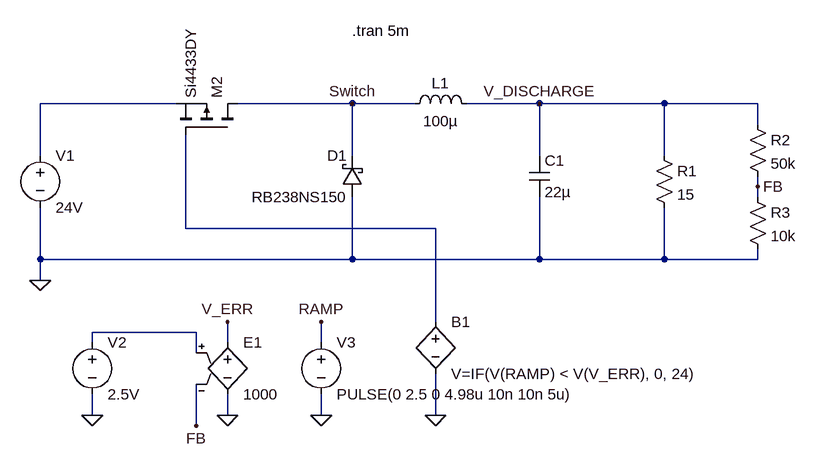
[diagram p0: schematic low_voltage_bucks.asc]
low_voltage_bucks.asc, the LTspice schematic file:
Version 4
SHEET 1 1580 680
WIRE 400 96 192 96
WIRE 672 96 496 96
WIRE 768 96 672 96
WIRE 960 96 848 96
WIRE 1152 96 960 96
WIRE 1296 96 1152 96
WIRE 1296 128 1296 96
WIRE 192 176 192 96
WIRE 672 176 672 96
WIRE 960 176 960 96
WIRE 1152 176 1152 96
WIRE 1296 224 1296 208
WIRE 1296 240 1296 224
WIRE 416 288 416 144
WIRE 800 288 416 288
WIRE 192 336 192 256
WIRE 672 336 672 240
WIRE 672 336 192 336
WIRE 960 336 960 240
WIRE 960 336 672 336
WIRE 1152 336 1152 256
WIRE 1152 336 960 336
WIRE 1296 336 1296 320
WIRE 1296 336 1152 336
WIRE 192 368 192 336
WIRE 800 432 800 288
WIRE 432 448 272 448
WIRE 272 464 272 448
WIRE 480 464 480 432
WIRE 624 464 624 432
WIRE 432 480 432 448
WIRE 272 576 272 544
WIRE 480 576 480 544
WIRE 624 576 624 544
WIRE 800 576 800 512
WIRE 432 592 432 528
FLAG 192 368 0
FLAG 672 96 Switch
FLAG 960 96 V_DISCHARGE
FLAG 480 576 0
FLAG 272 576 0
FLAG 480 432 V_ERR
FLAG 1296 224 FB
FLAG 432 592 FB
FLAG 624 432 RAMP
FLAG 800 576 0
FLAG 624 576 0
SYMBOL voltage 192 160 R0
SYMATTR InstName V1
SYMATTR Value 24V
SYMBOL schottky 688 240 R180
WINDOW 0 24 64 Left 2
WINDOW 3 24 0 Left 2
SYMATTR InstName D1
SYMATTR Value RB238NS150
SYMATTR Description Diode
SYMATTR Type diode
SYMBOL ind 752 112 R270
WINDOW 0 32 56 VTop 2
WINDOW 3 5 56 VBottom 2
SYMATTR InstName L1
SYMATTR Value 100µ
SYMBOL cap 944 176 R0
SYMATTR InstName C1
SYMATTR Value 22µ
SYMBOL res 1136 160 R0
SYMATTR InstName R1
SYMATTR Value 15
SYMBOL pmos 496 144 M270
SYMATTR InstName M2
SYMATTR Value Si4433DY
SYMBOL res 1280 112 R0
SYMATTR InstName R2
SYMATTR Value 50k
SYMBOL res 1280 224 R0
SYMATTR InstName R3
SYMATTR Value 10k
SYMBOL voltage 272 448 R0
SYMATTR InstName V2
SYMATTR Value 2.5V
SYMBOL e 480 448 R0
SYMATTR InstName E1
SYMATTR Value 1000
SYMBOL voltage 624 448 R0
SYMATTR InstName V3
SYMATTR Value PULSE(0 2.5 0 4.98u 10n 10n 5u)
SYMBOL bv 800 416 R0
SYMATTR InstName B1
SYMATTR Value V=IF(V(RAMP) < V(V_ERR), 0, 24)
TEXT 672 -16 Left 2 !.tran 5m

The netlist it stands for:
* low_voltage_bucks.asc
V1 N001 0 24V
D1 0 Switch RB238NS150
L1 Switch V_DISCHARGE 100µ
C1 V_DISCHARGE 0 22µ
R1 V_DISCHARGE 0 15
M2 Switch N002 N001 N001 Si4433DY
R2 V_DISCHARGE FB 50k
R3 FB 0 10k
V2 N003 0 2.5V
E1 V_ERR 0 N003 FB 1000
V3 RAMP 0 PULSE(0 2.5 0 4.98u 10n 10n 5u)
B1 N002 0 V=IF(V(RAMP) < V(V_ERR), 0, 24)
.model D D
.lib standard.dio
.model NMOS NMOS
.model PMOS PMOS
.lib standard.mos
.tran 5m
.backanno
.end